# Altium schematic sheet snowflake_r2.SchDoc
size C
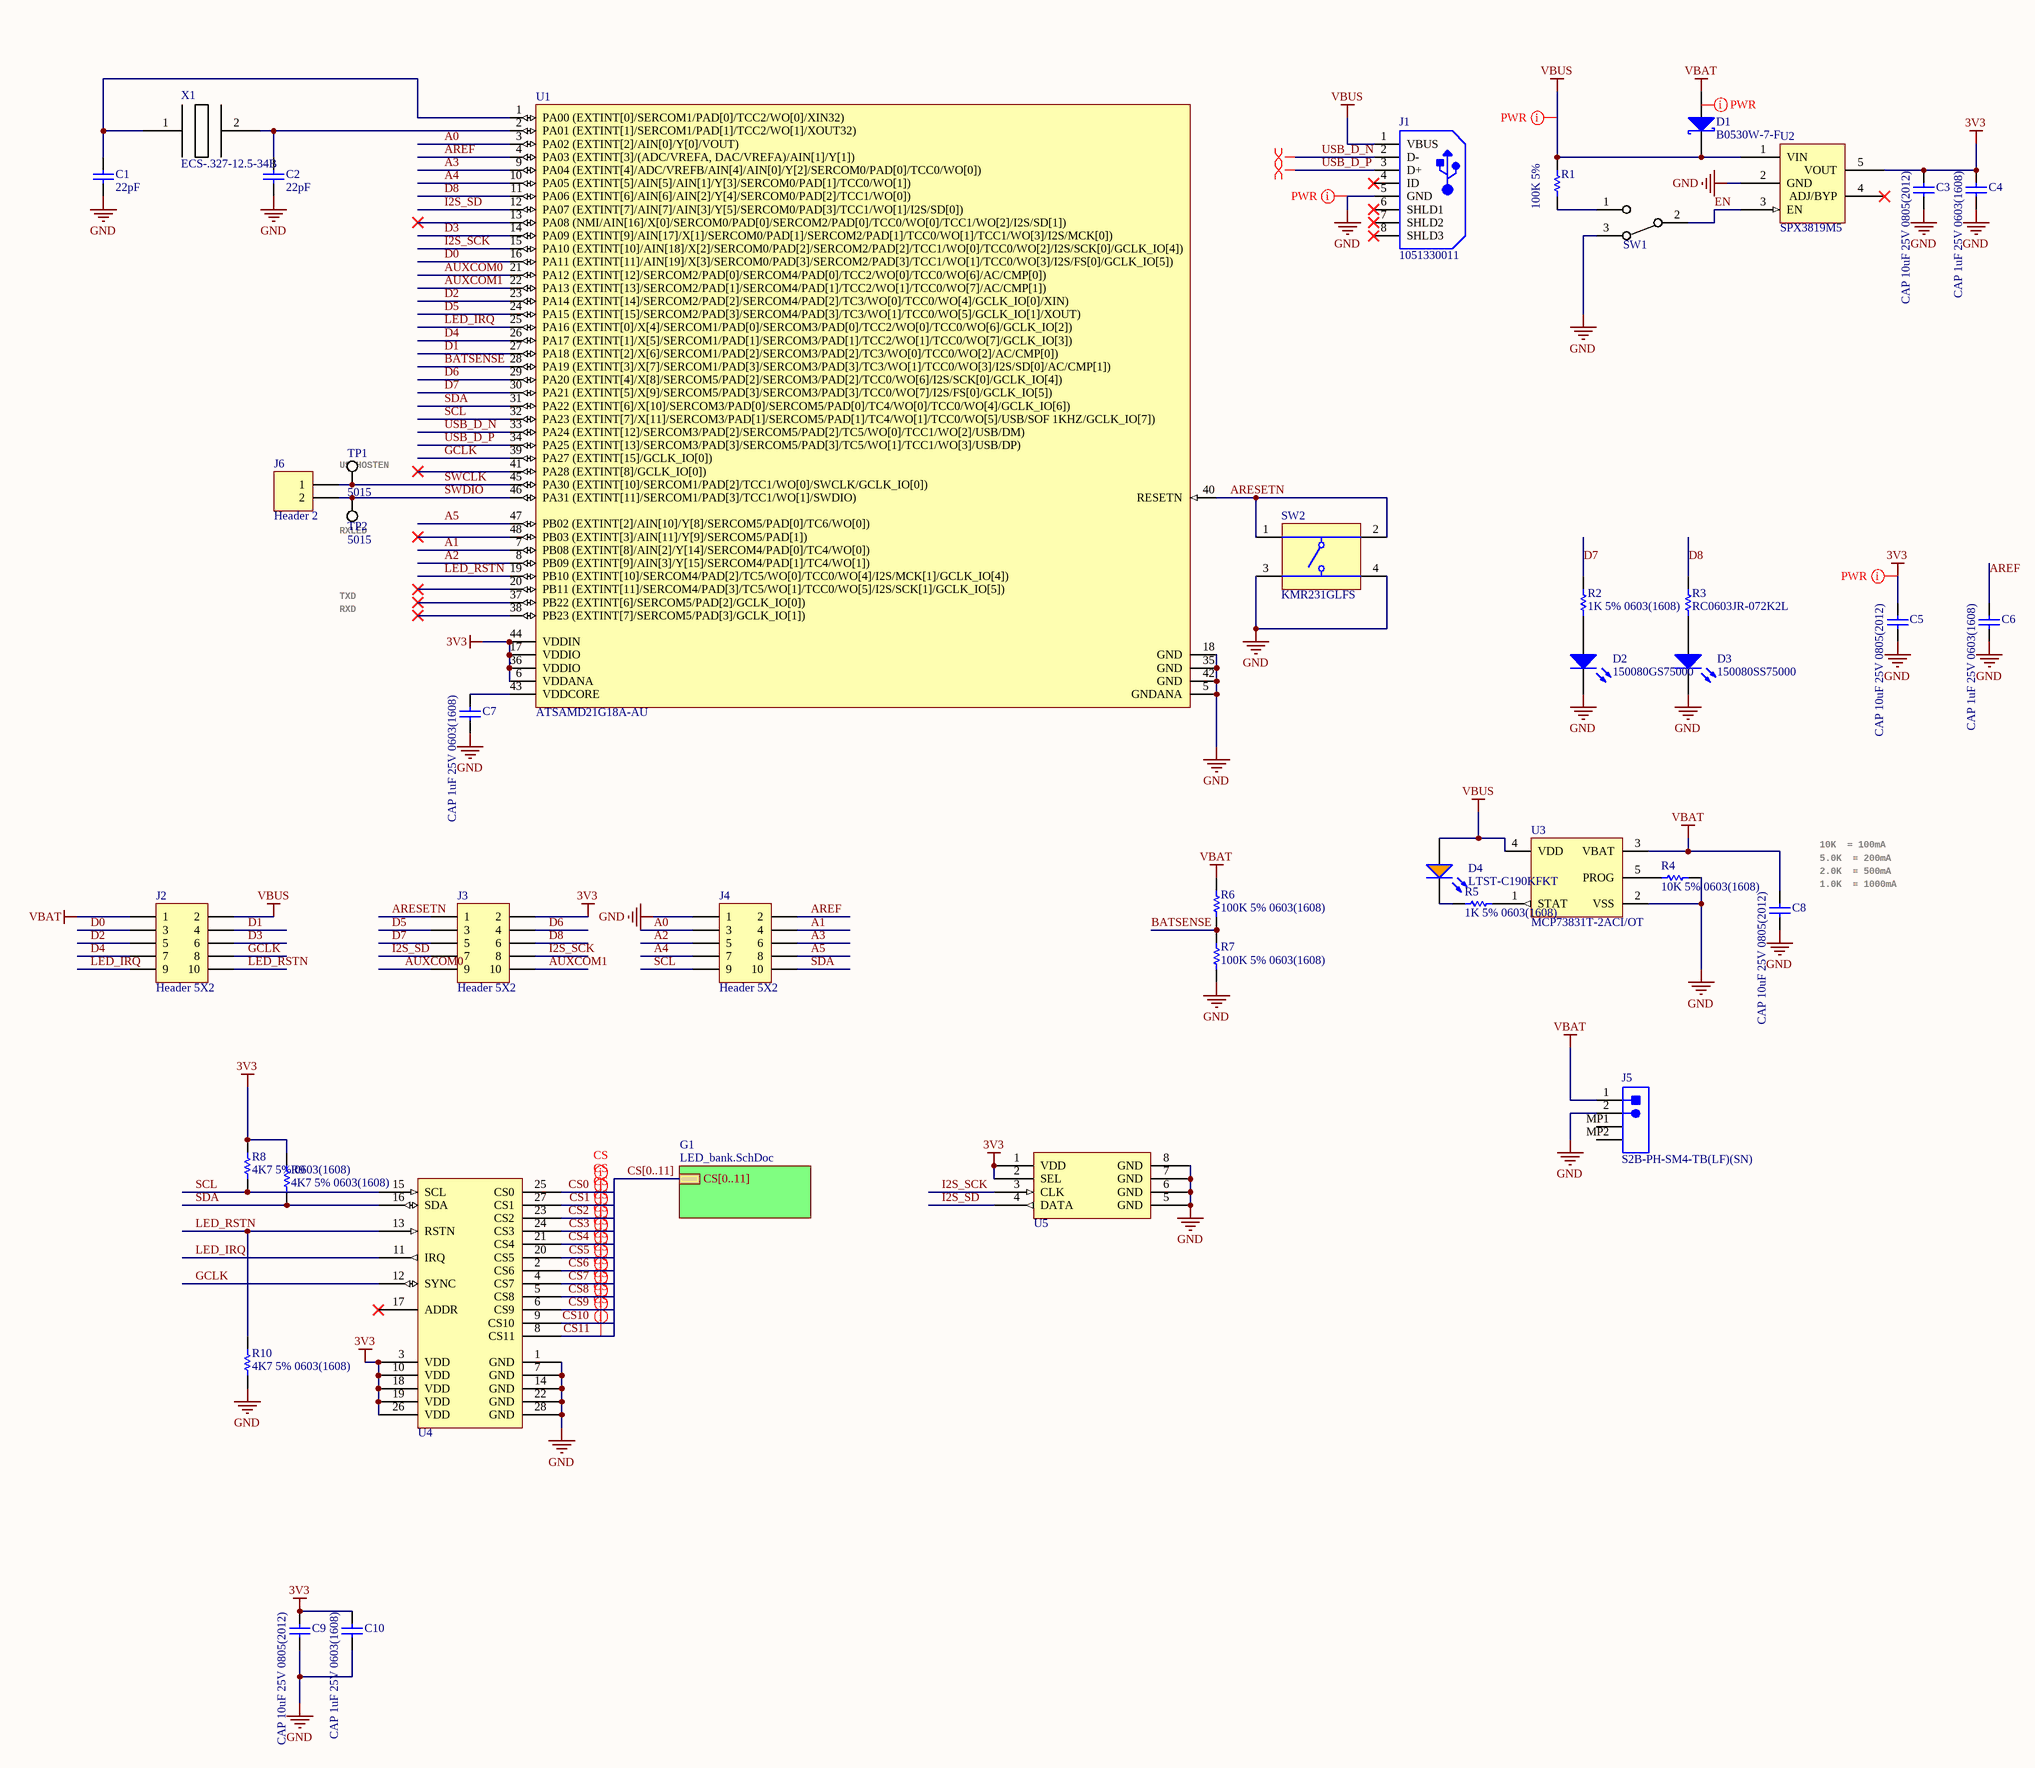
[diagram p0: snowflake_r2.SchDoc]

## Parts
C1  22pF  [CAPC0603(1608)100_L]
C2  22pF  [CAPC0603(1608)100_L]
C3  CAP 10uF 25V 0805(2012)  [CAPC0805(2012)145_N]
C4  CAP 1uF 25V 0603(1608)  [CAPC0603(1608)100_M]
C5  CAP 10uF 25V 0805(2012)  [CAPC0805(2012)145_N]
C6  CAP 1uF 25V 0603(1608)  [CAPC0603(1608)100_M]
C7  CAP 1uF 25V 0603(1608)  [CAPC0603(1608)100_M]
C8  CAP 10uF 25V 0805(2012)  [CAPC0805(2012)145_N]
C9  CAP 10uF 25V 0805(2012)  [CAPC0805(2012)145_N]
C10  CAP 1uF 25V 0603(1608)  [CAPC0603(1608)100_M]
D1  B0530W-7-F  [DIOD-SOD-123-2-A_V]
D2  150080GS75000  [0805_A]
D3  150080SS75000  [0805_A]
D4  LTST-C190KFKT  [LTST-C190KFKT_V]
J1  1051330011  [MOLX-1051330011-5_V]
J2  Header 5X2  [HDR2X5]
J3  Header 5X2  [HDR2X5]
J4  Header 5X2  [HDR2X5]
J5  S2B-PH-SM4-TB(LF)(SN)  [JST- S2B-PH-SM4-TB(LF)(SN)-2_V]
J6  Header 2  [HDR1X2]
R1  100K 5%  [RESC0603(1608)_N]
R2  1K 5% 0603(1608)  [RESC0603(1608)_L]
R3  RC0603JR-072K2L  [RESC1608X55X25LL10T15]
R4  10K 5% 0603(1608)  [RESC0603(1608)_N]
R5  1K 5% 0603(1608)  [RESC0603(1608)_L]
R6  100K 5% 0603(1608)  [RESC0603(1608)_N]
R7  100K 5% 0603(1608)  [RESC0603(1608)_N]
R8  4K7 5% 0603(1608)  [RESC0603(1608)_N]
R9  4K7 5% 0603(1608)  [RESC0603(1608)_N]
R10  4K7 5% 0603(1608)  [RESC0603(1608)_N]
SW1  JS102011JCQN  [JS102011JCQN]  (value not drawn)
SW2  KMR231GLFS  [CKCP-KMR231GLFS]
TP1  5015  [KSTN-5015_V]
TP2  5015  [KSTN-5015_V]
U1  ATSAMD21G18A-AU  [ATML-TQFP48_M]
U2  SPX3819M5  [SOT95P280X145-5N]
U3  MCP73831T-2ACI/OT  [SOT-23-OT5_M]
U4  AS1130_BTST  [TSOP65P640X120-28N]  (value not drawn)
U5  SPK0415HM4H-B-7  [SPK0415HM4H-B-7]  (value not drawn)
X1  ECS-.327-12.5-34B  [ECX-31B]

## Sub-sheets
G1 = LED_bank.SchDoc: CS[0..11]

## Nets
3V3: C3.2 C4.2 C5.2 C9.2 C10.2 J3.2 R8.2 R9.2 U1.6(VDDANA) U1.17(VDDIO) U1.36(VDDIO) U1.44(VDDIN) U2.5(VOUT) U4.3(VDD) U4.10(VDD) U4.18(VDD) U4.19(VDD) U4.26(VDD) U5.1(VDD) U5.2(SEL)
GND: C1.1 C2.1 C3.1 C4.1 C5.1 C6.1 C7.1 C8.1 C9.1 C10.1 D2.1(K) D3.1(K) J1.5(GND) J4.1 J5.2 R4.1 R7.1 R10.1 SW1.3(A1) SW2.3 SW2.4 U1.5(GNDANA) U1.18(GND) U1.35(GND) U1.42(GND) U2.2(GND) U3.2(VSS) U4.1(GND) U4.7(GND) U4.14(GND) U4.22(GND) U4.28(GND) U5.5(GND) U5.6(GND) U5.7(GND) U5.8(GND)
VBAT: C8.2 D1.1(A) J2.1 J5.1 R6.2 U3.3(VBAT)
VBUS: D1.2(K) D4.1(A) J1.1(VBUS) J2.2 R1.2 U2.1(VIN) U3.4(VDD)
A0: J4.3 U1.3(PA02_(EXTINT[2]/AIN[0]/Y[0]/VOUT))
A1: J4.4 U1.7(PB08_(EXTINT[8]/AIN[2]/Y[14]/SERCOM4/PAD[0]/TC4/WO[0]))
A2: J4.5 U1.8(PB09_(EXTINT[9]/AIN[3]/Y[15]/SERCOM4/PAD[1]/TC4/WO[1]))
A3: J4.6 U1.9(PA04_(EXTINT[4]/ADC/VREFB/AIN[4]/AIN[0]/Y[2]/SERCOM0/PAD[0]/TCC0/WO[0]))
A4: J4.7 U1.10(PA05_(EXTINT[5]/AIN[5]/AIN[1]/Y[3]/SERCOM0/PAD[1]/TCC0/WO[1]))
A5: J4.8 U1.47(PB02_(EXTINT[2]/AIN[10]/Y[8]/SERCOM5/PAD[0]/TC6/WO[0]))
AREF: C6.2 J4.2 U1.4(PA03_(EXTINT[3]/(ADC/VREFA,_DAC/VREFA)/AIN[1]/Y[1]))
ARESETN: J3.1 SW2.1 SW2.2 U1.40(RESETN)
AUXCOM0: J3.9 U1.21(PA12_(EXTINT[12]/SERCOM2/PAD[0]/SERCOM4/PAD[0]/TCC2/WO[0]/TCC0/WO[6]/AC/CMP[0]))
AUXCOM1: J3.10 U1.22(PA13_(EXTINT[13]/SERCOM2/PAD[1]/SERCOM4/PAD[1]/TCC2/WO[1]/TCC0/WO[7]/AC/CMP[1]))
BATSENSE: R6.1 R7.2 U1.28(PA19_(EXTINT[3]/X[7]/SERCOM1/PAD[3]/SERCOM3/PAD[3]/TC3/WO[1]/TCC0/WO[3]/I2S/SD[0]/AC/CMP[1]))
CS0: U4.25(CS0)
CS1: U4.27(CS1)
CS2: U4.23(CS2)
CS3: U4.24(CS3)
CS4: U4.21(CS4)
CS5: U4.20(CS5)
CS6: U4.2(CS6)
CS7: U4.4(CS7)
CS8: U4.5(CS8)
CS9: U4.6(CS9)
CS10: U4.9(CS10)
CS11: U4.8(CS11)
D0: J2.3 U1.16(PA11_(EXTINT[11]/AIN[19]/X[3]/SERCOM0/PAD[3]/SERCOM2/PAD[3]/TCC1/WO[1]/TCC0/WO[3]/I2S/FS[0]/GCLK_IO[5]))
D1: J2.4 U1.27(PA18_(EXTINT[2]/X[6]/SERCOM1/PAD[2]/SERCOM3/PAD[2]/TC3/WO[0]/TCC0/WO[2]/AC/CMP[0]))
D2: J2.5 U1.23(PA14_(EXTINT[14]/SERCOM2/PAD[2]/SERCOM4/PAD[2]/TC3/WO[0]/TCC0/WO[4]/GCLK_IO[0]/XIN))
D3: J2.6 U1.14(PA09_(EXTINT[9]/AIN[17]/X[1]/SERCOM0/PAD[1]/SERCOM2/PAD[1]/TCC0/WO[1]/TCC1/WO[3]/I2S/MCK[0]))
D4: J2.7 U1.26(PA17_(EXTINT[1]/X[5]/SERCOM1/PAD[1]/SERCOM3/PAD[1]/TCC2/WO[1]/TCC0/WO[7]/GCLK_IO[3]))
D5: J3.3 U1.24(PA15_(EXTINT[15]/SERCOM2/PAD[3]/SERCOM4/PAD[3]/TC3/WO[1]/TCC0/WO[5]/GCLK_IO[1]/XOUT))
D6: J3.4 U1.29(PA20_(EXTINT[4]/X[8]/SERCOM5/PAD[2]/SERCOM3/PAD[2]/TCC0/WO[6]/I2S/SCK[0]/GCLK_IO[4]))
D7: J3.5 R2.2 U1.30(PA21_(EXTINT[5]/X[9]/SERCOM5/PAD[3]/SERCOM3/PAD[3]/TCC0/WO[7]/I2S/FS[0]/GCLK_IO[5]))
D8: J3.6 R3.2 U1.11(PA06_(EXTINT[6]/AIN[6]/AIN[2]/Y[4]/SERCOM0/PAD[2]/TCC1/WO[0]))
EN: SW1.2 U2.3(EN)
GCLK: J2.8 U1.39(PA27_(EXTINT[15]/GCLK_IO[0])) U4.12(SYNC)
I2S_SCK: J3.8 U1.15(PA10_(EXTINT[10]/AIN[18]/X[2]/SERCOM0/PAD[2]/SERCOM2/PAD[2]/TCC1/WO[0]/TCC0/WO[2]/I2S/SCK[0]/GCLK_IO[4])) U5.3(CLK)
I2S_SD: J3.7 U1.12(PA07_(EXTINT[7]/AIN[7]/AIN[3]/Y[5]/SERCOM0/PAD[3]/TCC1/WO[1]/I2S/SD[0])) U5.4(DATA)
LED_IRQ: J2.9 U1.25(PA16_(EXTINT[0]/X[4]/SERCOM1/PAD[0]/SERCOM3/PAD[0]/TCC2/WO[0]/TCC0/WO[6]/GCLK_IO[2])) U4.11(IRQ)
LED_RSTN: J2.10 R10.2 U1.19(PB10_(EXTINT[10]/SERCOM4/PAD[2]/TC5/WO[0]/TCC0/WO[4]/I2S/MCK[1]/GCLK_IO[4])) U4.13(RSTN)
SCL: J4.9 R8.1 U1.32(PA23_(EXTINT[7]/X[11]/SERCOM3/PAD[1]/SERCOM5/PAD[1]/TC4/WO[1]/TCC0/WO[5]/USB/SOF_1KHZ/GCLK_IO[7])) U4.15(SCL)
SDA: J4.10 R9.1 U1.31(PA22_(EXTINT[6]/X[10]/SERCOM3/PAD[0]/SERCOM5/PAD[0]/TC4/WO[0]/TCC0/WO[4]/GCLK_IO[6])) U4.16(SDA)
SWCLK: J6.1 TP1.1 U1.45(PA30_(EXTINT[10]/SERCOM1/PAD[2]/TCC1/WO[0]/SWCLK/GCLK_IO[0]))
SWDIO: J6.2 TP2.1 U1.46(PA31_(EXTINT[11]/SERCOM1/PAD[3]/TCC1/WO[1]/SWDIO))
USB_D_N: J1.2(D-) U1.33(PA24_(EXTINT[12]/SERCOM3/PAD[2]/SERCOM5/PAD[2]/TC5/WO[0]/TCC1/WO[2]/USB/DM))
USB_D_P: J1.3(D+) U1.34(PA25_(EXTINT[13]/SERCOM3/PAD[3]/SERCOM5/PAD[3]/TC5/WO[1]/TCC1/WO[3]/USB/DP))
NetC1_2: C1.2 U1.1(PA00_(EXTINT[0]/SERCOM1/PAD[0]/TCC2/WO[0]/XIN32)) X1.1
NetC2_2: C2.2 U1.2(PA01_(EXTINT[1]/SERCOM1/PAD[1]/TCC2/WO[1]/XOUT32)) X1.2
NetC7_2: C7.2 U1.43(VDDCORE)
NetD2_2: D2.2(A) R2.1
NetD3_2: D3.2(A) R3.1
NetD4_2: D4.2(K) R5.2
NetR1_1: R1.1 SW1.1(B1)
NetR4_2: R4.2 U3.5(PROG)
NetR5_1: R5.1 U3.1(STAT)

Not connected (* = marked no-connect by the designer): J1 4(ID)* 6(SHLD1)* 7(SHLD2)* 8(SHLD3)*; J5 MP1 MP2; U1 13(PA08_(NMI/AIN[16]/X[0]/SERCOM0/PAD[0]/SERCOM2/PAD[0]/TCC0/WO[0]/TCC1/WO[2]/I2S/SD[1]))* 20(PB11_(EXTINT[11]/SERCOM4/PAD[3]/TC5/WO[1]/TCC0/WO[5]/I2S/SCK[1]/GCLK_IO[5]))* 37(PB22_(EXTINT[6]/SERCOM5/PAD[2]/GCLK_IO[0]))* 38(PB23_(EXTINT[7]/SERCOM5/PAD[3]/GCLK_IO[1]))* 41(PA28_(EXTINT[8]/GCLK_IO[0]))* 48(PB03_(EXTINT[3]/AIN[11]/Y[9]/SERCOM5/PAD[1]))*; U2 4(ADJ/BYP)*; U4 17(ADDR)*

## Buses and harness runs
bus CS[0..11] = sheet G1/CS[0..11]

## Layout directives
net class PWR: 3V3, (no net found under the mark), GND, VBUS
differential pair: USB_D_N, USB_D_P
net class CS: CS0, CS1, CS2, CS3, CS4, CS5, CS6, CS7, CS8, CS9, CS10, CS11

## Notes on the sheet
- (near TP1) USBHOSTEN
- (near TP2) RXLED
- TXD
- RXD
- 10K  = 100mA
- 5.0K  = 200mA
- (near C8) 2.0K  = 500mA
- (near C8) 1.0K  = 1000mA

## Library data of the parts
C1 C2 = CMP-1590-00005-1: 0603 (1608 Metric) Chip Capacitor; Case-Metric: 1608; Case-EIA: 0603; PackageReference: CAPC0603(1608)100
C3 C5 C8 C9 = CMP-1036-04932-1: CAP 10uF 25V ±10% 0805 (2012 Metric) Thickness 1.45mm SMD; Case-EIA: 0805; Case-Metric: 2012; Tolerance: Â±10%; Technology: SMT; Value: 10uF; Rated Voltage: 25 V; Max Thickness: 1.45 mm
C4 C6 C7 C10 = CMP-1035-02741-1: CAP 1uF 25V ±20% 0603 (1608 Metric) Thickness 1mm SMD; Tolerance: Â±20%; Case-EIA: 0603; Case-Metric: 1608; Max Thickness: 1 mm; Technology: SMT; Rated Voltage: 25 V; Value: 1uF
D1 = CMP-2000-05879-1: Schottky Barrier Rectifier, 0.5 A, 30 V, -65 to 125 degC, 2-Pin SOD-123, RoHS, Tape and Reel; Ifsm - Forward Surge Current: 5.5A; Type: 0.5ASurfaceMountSchottkyBarrierRectifier; Ir - Reverse Current: 130uA; Brand: DiodesIncorporated; Vrrm - Repetitive Reverse Voltage: 30V; Vf - Forward Voltage: 0.43V; Unit Weight: 0.000353oz; If - Forward Current: 0.5A; Pd - Power Dissipation: 410mW; Configuration: Single; Height: 1.25mm; Packaging: Reel; Product Category: SchottkyDiodes&Rectifiers; Maximum Operating Temperature: +125C; Datasheet Version: Rev. 9-2, 06/2008; Manufacturer URL: http://www.diodes.com/; Width: 1.7mm; Manufacturer: DiodesIncorporated; Mounting Style: SMD/SMT; Factory Pack Quantity: 3000; Package Description: 2-Pin Small Outline Diode, Body 2.7 x 1.55 mm; Product: SchottkyDiodes; Minimum Operating Temperature: -65C; Operating Temperature Range: -65Cto+125C; Package Reference: SOD-123-2; Datasheet URL: http://www.diodes.com/_files/datasheets/ds30139.pdf; Length: 2.85mm; Mounting Technology: SurfaceMount; RoHS: True; Series: B0530; Package / Case: SOD-123; Technology: Si; Termination Style: SMD/SMT
D2 = CMP-1426-00007-1: SMD mono-color Chip LED, WL-SMCW, Green; Manufacturer: Wuerth Elektronik; PackageReference: 0805_A; Color: Green; PartNumber: 150080GS75000; ComponentLink2URL: http://katalog.we-online.com/led/datasheet/150080GS75000.pdf; ComponentLink1URL: http://www.we-online.com; ComponentLink1Description: Manufacturer URL; ComponentLink2Description: Datasheet
D3 = CMP-1426-00010-1: SMD mono-color Chip LED, WL-SMCW, Super Red; Manufacturer: Wuerth Elektronik; PackageReference: 0805_A; ComponentLink2URL: http://katalog.we-online.com/led/datasheet/150080SS75000.pdf; ComponentLink1URL: http://www.we-online.com; Color: Super Red; ComponentLink2Description: Datasheet; ComponentLink1Description: Manufacturer URL; PartNumber: 150080SS75000
D4 = CMP-1674-00008-1: LED Uni-Color Orange, 75 mW, 30 mA, -35 to 85 degC, 2-Pin SMD, RoHS, Tape and Reel; Resistance: 47 kohm; Power Rating: 100 mW; Case\Package: 0603; Tolerance: 1%; Voltage Rating (DC): 50 V; ComponentLink2URL: http://optoelectronics.liteon.com/upload/download/DS-22-99-0186/S_110_LTST-C190KFKT.pdf; Mount: Surface Mount; Pins: 2; Package Quantity: 5000; Max Operating Temperature: 155 degC; RoHSCompliant: true; PackageDescription: 2-Pin Surface Mount Device, Body 1.6 x 0.8 mm; Case Code (Metric): 1608; PackageReference: C190KFKT; Height: 0.45 mm; ComponentLink2Description: Datasheet; Min Operating Temperature: -55 degC; DatasheetVersion: Rev. I, 09/2011; Packaging: Tape and Reel; ComponentLink1Description: Manufacturer URL; ComponentLink1URL: http://www.us.liteon.com/; Voltage Rating: 50 V; Case Code (Imperial): 0603; Length: 1.6 mm; Width: 0.8 mm; REACH SVHC: No SVHC
J1 = CMP-2000-05241-1: Micro-B USB Vertical Type, -30 to 85 degC, 5-Pin SMD, RoHS, Tape and Reel; Manufacturer: Molex; PCN Other: 105133Series21/Jul/2015; Online Catalog: Molex-MicroUSB; Connector Type: USB-microB; 3D Model: 105133-0011.stp; Other Names: 105133-0011887191097947WM10134TR; Gender: Receptacle; PCN Packaging: 105133Series03/Oct/2015; Featured Product: USBConnectors; Number of Contacts: 5; Mounting Type: SurfaceMountVertical; Manufacturer URL: http://www.molex.com/; Features: BoardGuide; Standard Package: 500; Family: USB,DVI,HDMIConnectors; Ingress Protection: -; Datasheet Version: Rev. G, 01/2011; Packaging: Tape&Reel(TR); Specifications: -; RoHS Information: 105133-0011Cert.ofCompliance; Series: 105133; Datasheet URL: http://www.molex.com/pdm_docs/sd/1051330011_sd.pdf; Category: Connectors,Interconnects
J2-J4 = Header 5X2: Header, 5-Pin, Dual row; LatestRevisionDate: 17-Jul-2002; LatestRevisionNote: Re-released for DXP Platform.; Publisher: Altium Limited
J5 = CMP-1755-00001-1: Male Header, Pitch 2 mm, 1 x 2 Position, Height 5.5 mm, -25 to 85 degC, RoHS, Tape and Reel; Current Rating: 3 A; ComponentLink1URL: http://www.jst.com/home2.html; Radiation Hardening: No; RoHSCompliant: True; Mount: Through Hole; Contact Material: Bronze; Package Quantity: 100; Width: 2.34 mm; DatasheetVersion: Dec-12; Height: 8.13 mm; Max Operating Temperature: 105degC; ComponentLink2Description: Datasheet; Lead Pitch: 0.1 inch; Contact Finish: Lead; Packaging: Bulk; Colour: Black; Contact Plating: Tin; Min Operating Temperature: -65degC; ComponentLink1Description: Manufacturer URL; PackageReference: S2B-PH-SM4-TB(LF)(SN)-2; PackageDescription: Male Header, Pitch 2 mm, 1 x 2 Position, Height 5.5 mm; ComponentLink2URL: http://www.jst-mfg.com/product/pdf/eng/ePH.pdf; Pins: 40; Length: 101.19 mm
J6 = Header 2: Header, 2-Pin; LatestRevisionDate: 17-Jul-2002; LatestRevisionNote: Re-released for DXP Platform.; Publisher: Altium Limited
R1 R6 R7 = CMP-1012-00122-1: 100K 0.1W 5% 0603 (1608 Metric)  SMD; Case-EIA: 0603; Value: 100000.00 Ohm; Case-Metric: 1608; Tolerance: 5 %; Power: 0.1 W; Technology: SMT
R2 R5 = CMP-1012-00074-1: 1K 0.1W 5% 0603 (1608 Metric)  SMD; Case-EIA: 0603; Case-Metric: 1608; Value: 1000.00 Ohm; Technology: SMT; Tolerance: 5 %; Power: 0.1 W
R3 = CMP-2000-06957-1: Chip Resistor, 2.2 KOhm, +/- 5%, 0.1 W, -55 to 155 degC, 0603 (1608 Metric), RoHS, Tape and Reel; Manufacturer: Yageo; Resistance: 2.2kOhms; Temperature Coefficient: 100PPM/C; Voltage Rating: 50V; Power Rating: 100mW; Product: ThickFilmResistorsGeneralPurpose; Manufacturer URL: http://www.yageo.com/; Datasheet URL: http://www.yageo.com/documents/recent/PYu-RC_Group_51_RoHS_L_7.pdf; Package Description: 2-Pin Surface Mount Device, Body 1.6 x 0.8 mm; Mounting Technology: SurfaceMount; Case Code - mm: 1608; Case Code - in: 0603; Packaging: Reel; Operating Temperature Range: -55Cto+155C; Series: RC; Termination Style: SMD/SMT; Package Reference: 0603; Datasheet Version: Rev. 7, 05/2017; Tolerance: 5%
R4 = CMP-1012-00098-1: 10K 0.1W 5% 0603 (1608 Metric)  SMD; Case-EIA: 0603; Value: 10000.00 Ohm; Case-Metric: 1608; Technology: SMT; Tolerance: 5 %; Power: 0.1 W
R8-R10 = CMP-1012-00090-1: 4K7 0.1W 5% 0603 (1608 Metric)  SMD; Case-Metric: 1608; Value: 4700.00 Ohm; Case-EIA: 0603; Tolerance: 5 %; Technology: SMT; Power: 0.1 W
SW1 = SW-SPDT: SWITCH SPDT PCB
SW2 = CMP-2000-06516-1: Switch Tactile, SPST, 50 mA, 32 V, -40 to 85 degC, 4-Pin SMD, RoHS, Tape and Reel; Manufacturer: C&K Components; Mechanical Life: 150000Cycles; Switch Configuration: N.O.; Actuator Style: Button; Ground Terminal: Yes; Maximum DC Voltage Rating: 32V; Minimum Insulation Resistance: >=1000MOhm; Dielectric Strength: >=250Vrms; Operating Force: 3N; Illumination Type: N/R; Body Orientation: Straight; Contact Rating @ Voltage: 1A; Actuator Length: 0.5mm; Operating Temperature: -40to85C; Electrical Life: N/A; Housing Material: N/A; ECCN: EAR99; Pole Throw Configuration: SPST; Contact Plating: Silver; Dimension: 2.8x4.6x1.9mm; Type: Micro-Miniature; Product Weight: N/A; Package Description: 4-Pin Surface Mount Device, Body 4.6 x 2.8 mm; Actuator Color: N/A; HTS: 8536501199; Mounting Technology: SurfaceMount; Mounting: SurfaceMount,GullWing; Seal Location: N/A; Base Material: N/A; Family: KMR2; Part No: KMR231GLFS; Datasheet Version: 06/2016; Contact Material: Silver; Package Reference: KMR231GLFS; Manufacturer URL: http://www.ckswitches.com/; Maximum AC Voltage Rating: N/A; Datasheet URL: http://www.ck-components.com/media/1479/kmr2.pdf; RoHS: Yes; Seal Description: N/A; Packaging: TapeandReel; Supplier: C&KComponents
TP1 TP2 = CMP-2000-05183-1: Test Point, White, SMT; Manufacturer: Keystone; Primary Type: PCBTestPoints; Style: Miniature; Finish Plating: SilverPlate; Material, Contact: PhosphorBronze; Material: PhosphorBronze; Datasheet URL: https://datasheet.ciiva.com/1123/5015-1123862.pdf; Thickness: 0.010In.; Manufacturer URL: http://www.keyelco.com/; Datasheet Version: Mar-14; Contact Plating: Silver; Mounting Type: SurfaceMount; Termination: SMT; Type: TestPointsonTapeandReel; Height: 0.06In.; Mounting: SurfaceMount
U1 = CMP-2100-03585-1: SMART ARM-Based Microcontroller, 1.62 to 3.63 V, 256 KB Flash, 32 KB SRAM, -40 to 85 degC, 48-Pin TQFP, RoHS, Tray; Manufacturer: Atmel; Max Frequency: 48MHz; Number of Timers/Counters: 6; Max Supply Voltage: 3.63V; Min Supply Voltage: 1.62V; Packaging: Tray; Datasheet Version: Rev. N, 10/2016; Datasheet URL: http://www.atmel.com/images/atmel-42181-sam-d21_datasheet.pdf; REACH SVHC: NoSVHC; RoHSCompliant: true; Max Operating Temperature: 85degC; Manufacturer URL: http://www.atmel.com/; Contact Plating: Tin; Frequency: 48MHz; Package Description: 48-Pin Thin Profile Plastic Quad Flat Package, Body 7 x 7 mm, Pitch 0.5 mm; Package Reference: TQFP48; Lead Free: LeadFree; Number of Pins: 48; Min Operating Temperature: -40degC; Case/Package: TQFP; Mount: SurfaceMount
U2 = SPX3819M5: IC REG LINEAR 3.3V 500MA SOT23-5
U3 = CMP-0133-00143-1: Miniature Single-Cell, Fully Integrated Li-Ion, Li-Polymer Charge Management Controller, 4.2V, 5-Pin SOT-23, Industrial Temperature, Tape and Reel; PackageReference: SOT-23-OT5; PackageDescription: 5-Lead Plastic Small Outline Transistor (OT) [SOT-23]; PackageVersion: revBB, Aug-2009; DatasheetVersion: revE, Sep-2008; Code_IPC: SOT23-5
U4 = AS1130_BTST: IC LED DRVR MATRIX 28TSSOP
U5 = SPK0415HM4H-B-7: MIC MEMS DIGITAL PDM OMNI -26DB
X1 = ECS-.327-12.5-34B: XTAL 32.768KHZ 12.5PF SMD